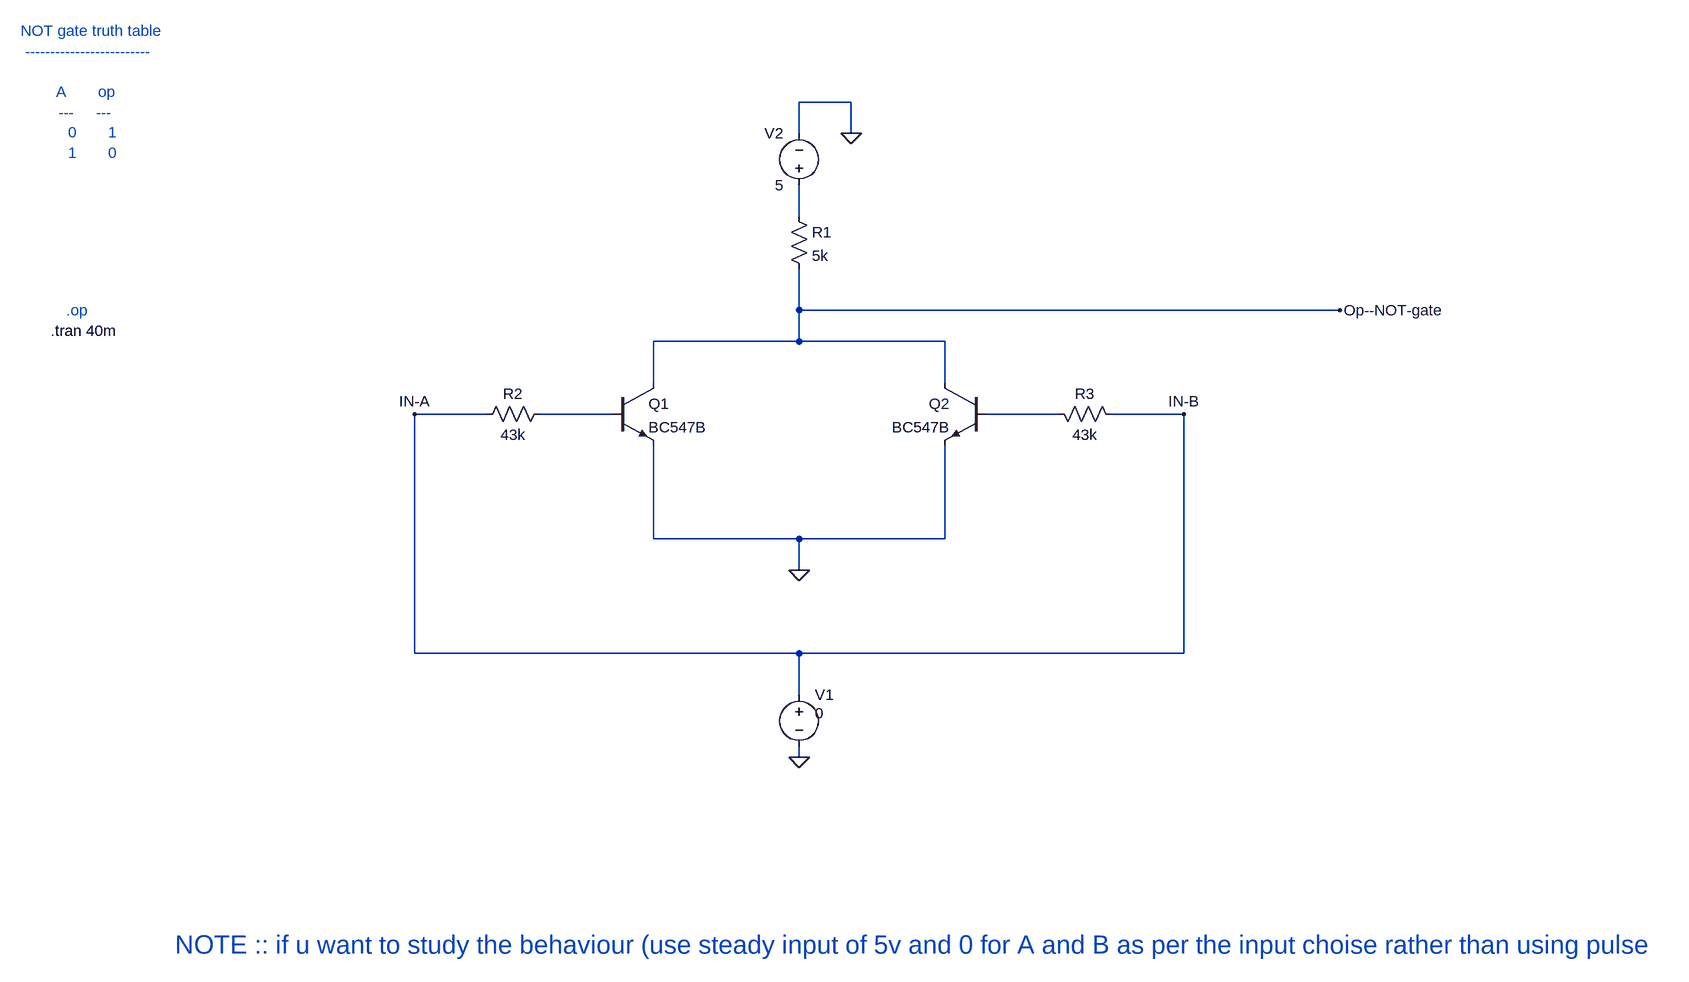
[diagram p0: schematic NOT_using_NOR_gate.asc]
NOT_using_NOR_gate.asc, the LTspice schematic file:
Version 4.1
SHEET 1 2536 1052
WIRE 432 -272 352 -272
WIRE 352 -224 352 -272
WIRE 432 -224 432 -272
WIRE 352 -96 352 -144
WIRE 352 48 352 -16
WIRE 1184 48 352 48
WIRE 352 96 352 48
WIRE 352 96 128 96
WIRE 576 96 352 96
WIRE 128 160 128 96
WIRE 576 160 576 96
WIRE -128 208 -240 208
WIRE 64 208 -48 208
WIRE 752 208 640 208
WIRE 944 208 832 208
WIRE 128 400 128 256
WIRE 352 400 128 400
WIRE 576 400 576 256
WIRE 576 400 352 400
WIRE 352 448 352 400
WIRE -240 576 -240 208
WIRE 352 576 -240 576
WIRE 944 576 944 208
WIRE 944 576 352 576
WIRE 352 640 352 576
WIRE 352 736 352 720
FLAG -240 208 IN-A
FLAG 352 736 0
FLAG 944 208 IN-B
FLAG 352 448 0
FLAG 432 -224 0
FLAG 1184 48 Op--NOT-gate
SYMBOL voltage 352 624 R0
WINDOW 3 24 44 Left 2
WINDOW 123 0 0 Left 0
WINDOW 39 0 0 Left 0
SYMATTR Value 0
SYMATTR InstName V1
SYMBOL npn 64 160 R0
SYMATTR InstName Q1
SYMATTR Value BC547B
SYMBOL voltage 352 -128 R180
WINDOW 0 24 96 Left 2
WINDOW 3 24 16 Left 2
WINDOW 123 0 0 Left 0
WINDOW 39 0 0 Left 0
SYMATTR InstName V2
SYMATTR Value 5
SYMBOL res 336 -112 R0
SYMATTR InstName R1
SYMATTR Value 5k
SYMBOL res -32 192 R90
WINDOW 0 0 56 VBottom 2
WINDOW 3 32 56 VTop 2
SYMATTR InstName R2
SYMATTR Value 43k
SYMBOL npn 640 160 M0
SYMATTR InstName Q2
SYMATTR Value BC547B
SYMBOL res 736 192 M90
WINDOW 0 0 56 VBottom 2
WINDOW 3 32 56 VTop 2
SYMATTR InstName R3
SYMATTR Value 43k
TEXT -800 80 Left 2 !.tran 40m
TEXT -776 48 Left 2 ;.op
TEXT -736 -288 Center 2 ;NOT gate truth table\n-------------------------\n \nA       op   \n---     ---   \n0       1\n1       0
TEXT -608 1024 Left 4 ;NOTE :: if u want to study the behaviour (use steady input of 5v and 0 for A and B as per the input choise rather than using pulse

The netlist it stands for:
* NOT_using_NOR_gate.asc
V1 IN-B 0 0
Q1 Op--NOT-gate N002 0 0 BC547B
V2 N001 0 5
R1 N001 Op--NOT-gate 5k
R2 N002 IN-B 43k
Q2 Op--NOT-gate N003 0 0 BC547B
R3 N003 IN-B 43k
.model NPN NPN
.model PNP PNP
.lib standard.bjt
.tran 40m
* .op
* NOT gate truth table
* -------------------------
* A       op
* ---     ---
* 0       1
* 1       0
* NOTE :: if u want to study the behaviour (use steady input of 5v and 0 for A and B as per the input choise rather than using pulse
.backanno
.end